# Altium schematic sheet Sheet1.SchDoc
size A2; PageSetup: Record=PageOptions?CenterHorizontal=True?CenterVertical=True?PrintScale=1.00?XCorrection=1.00?YCorrection=1.00?PrintKind=1?BorderSize=5000000?LeftOffset=0?BottomOffset=0?Orientation=2?PaperLength=1000?PaperWidth=1000?Scale=100?PaperSource=7?PrintQuality=-4?MediaType=1?DitherType=10?PaperKind=A4?PrintScaleMode=1
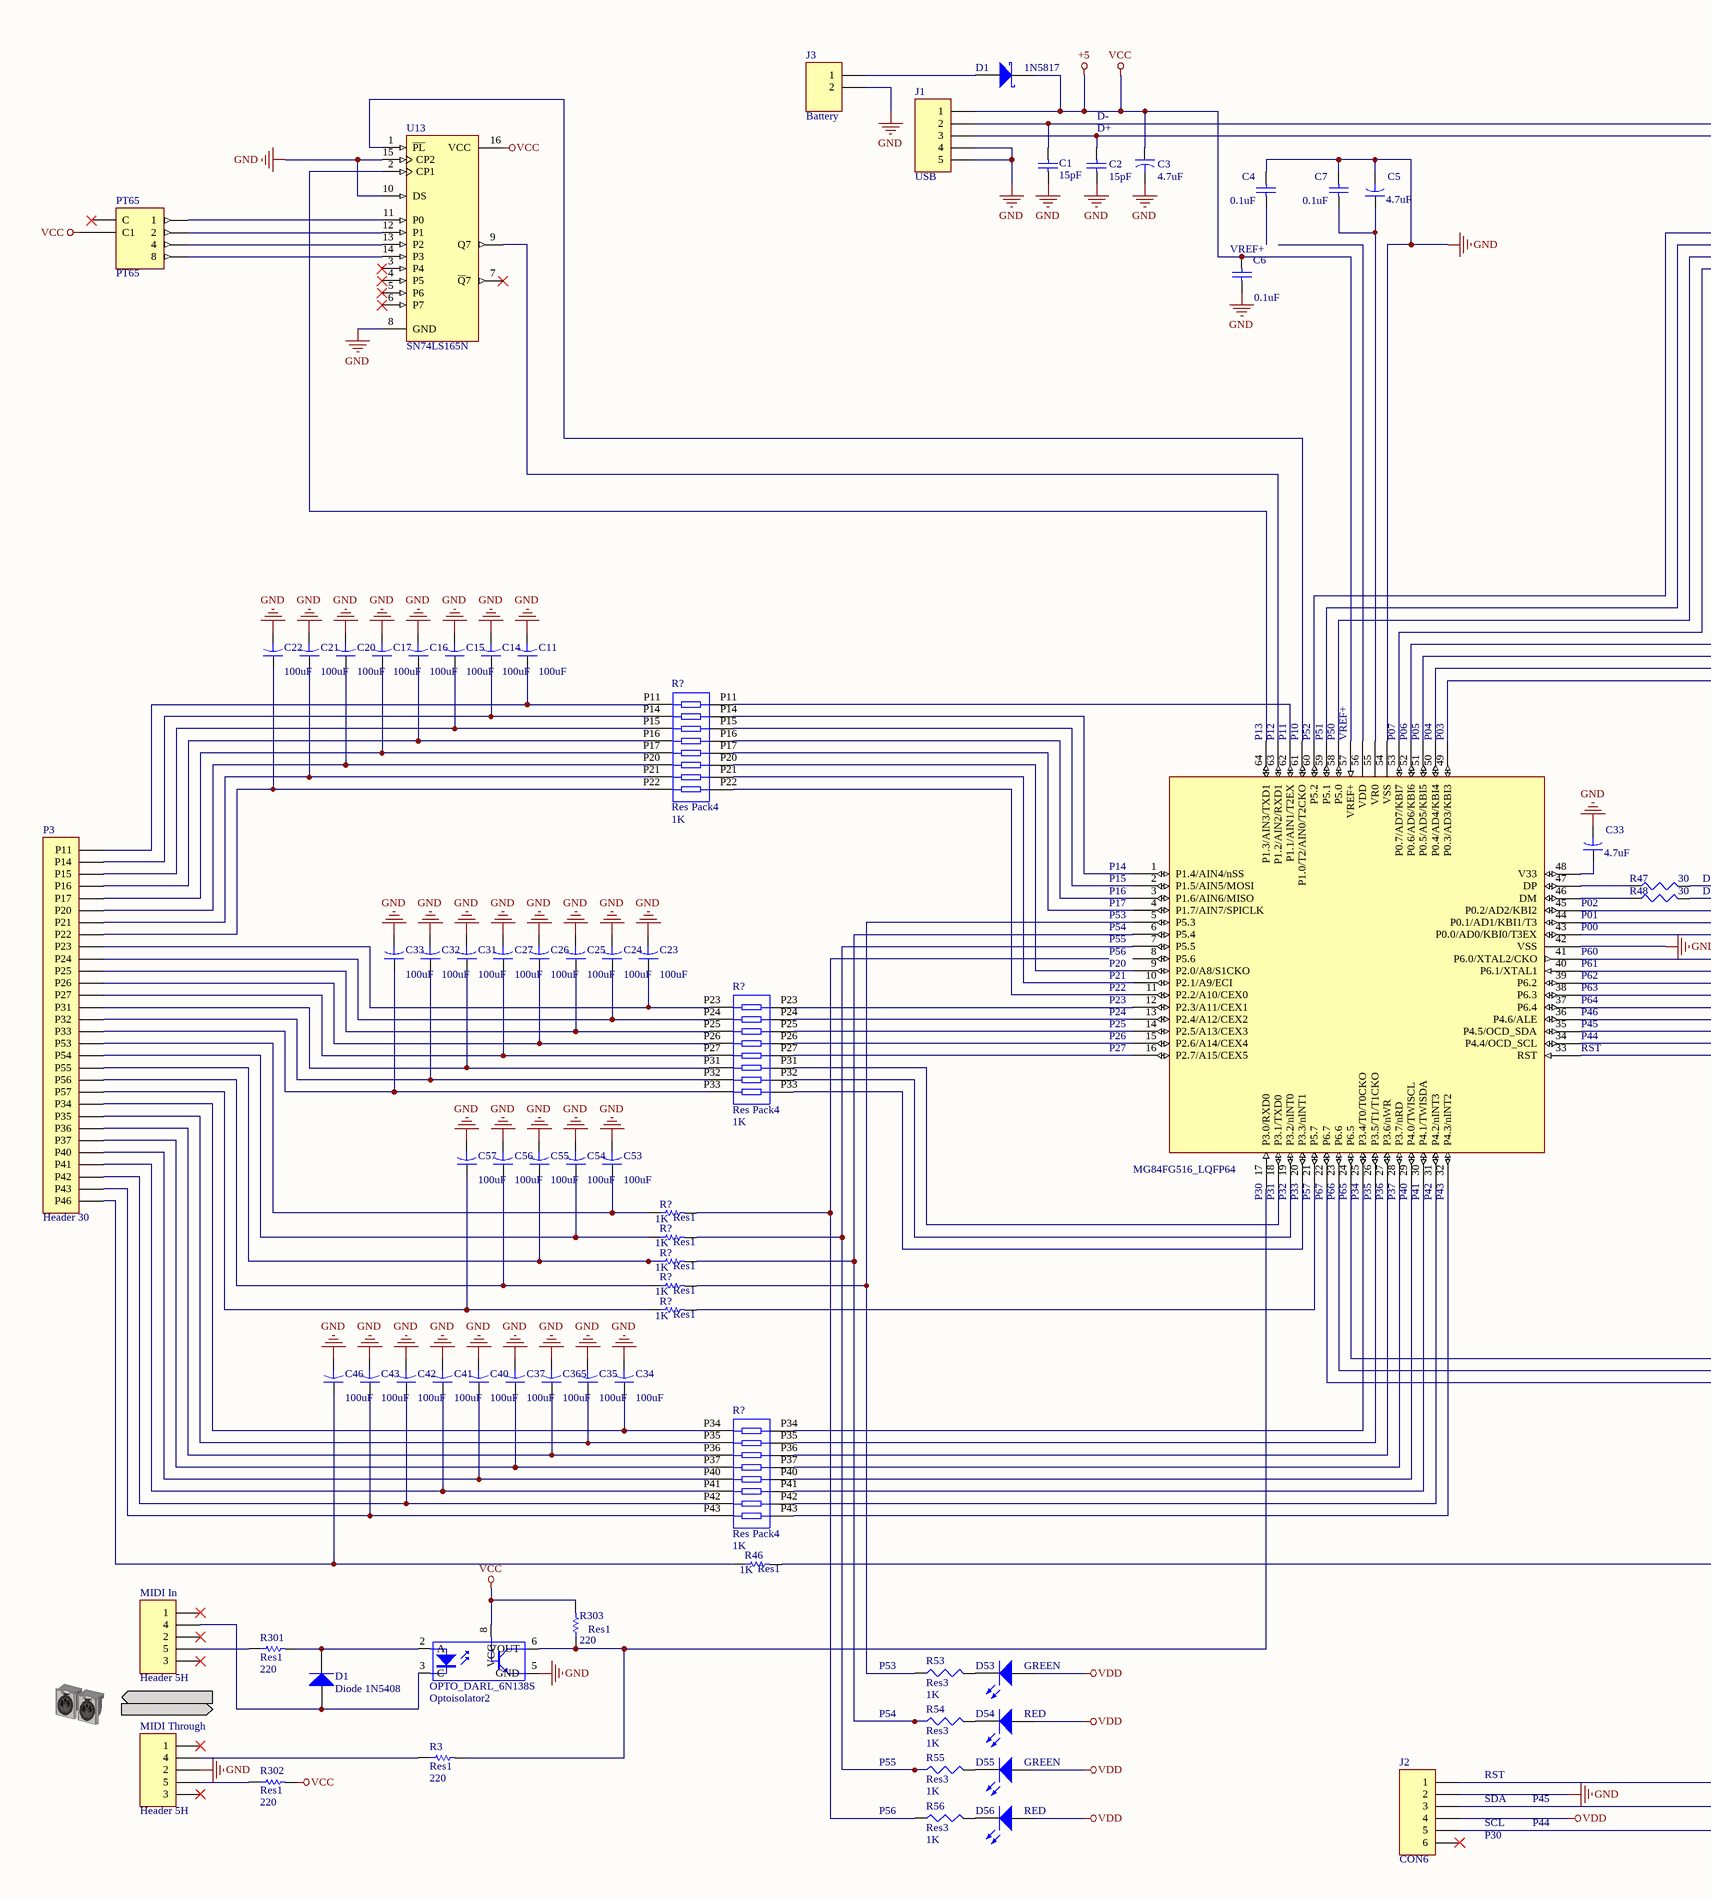
[diagram p0: Sheet1.SchDoc, left]
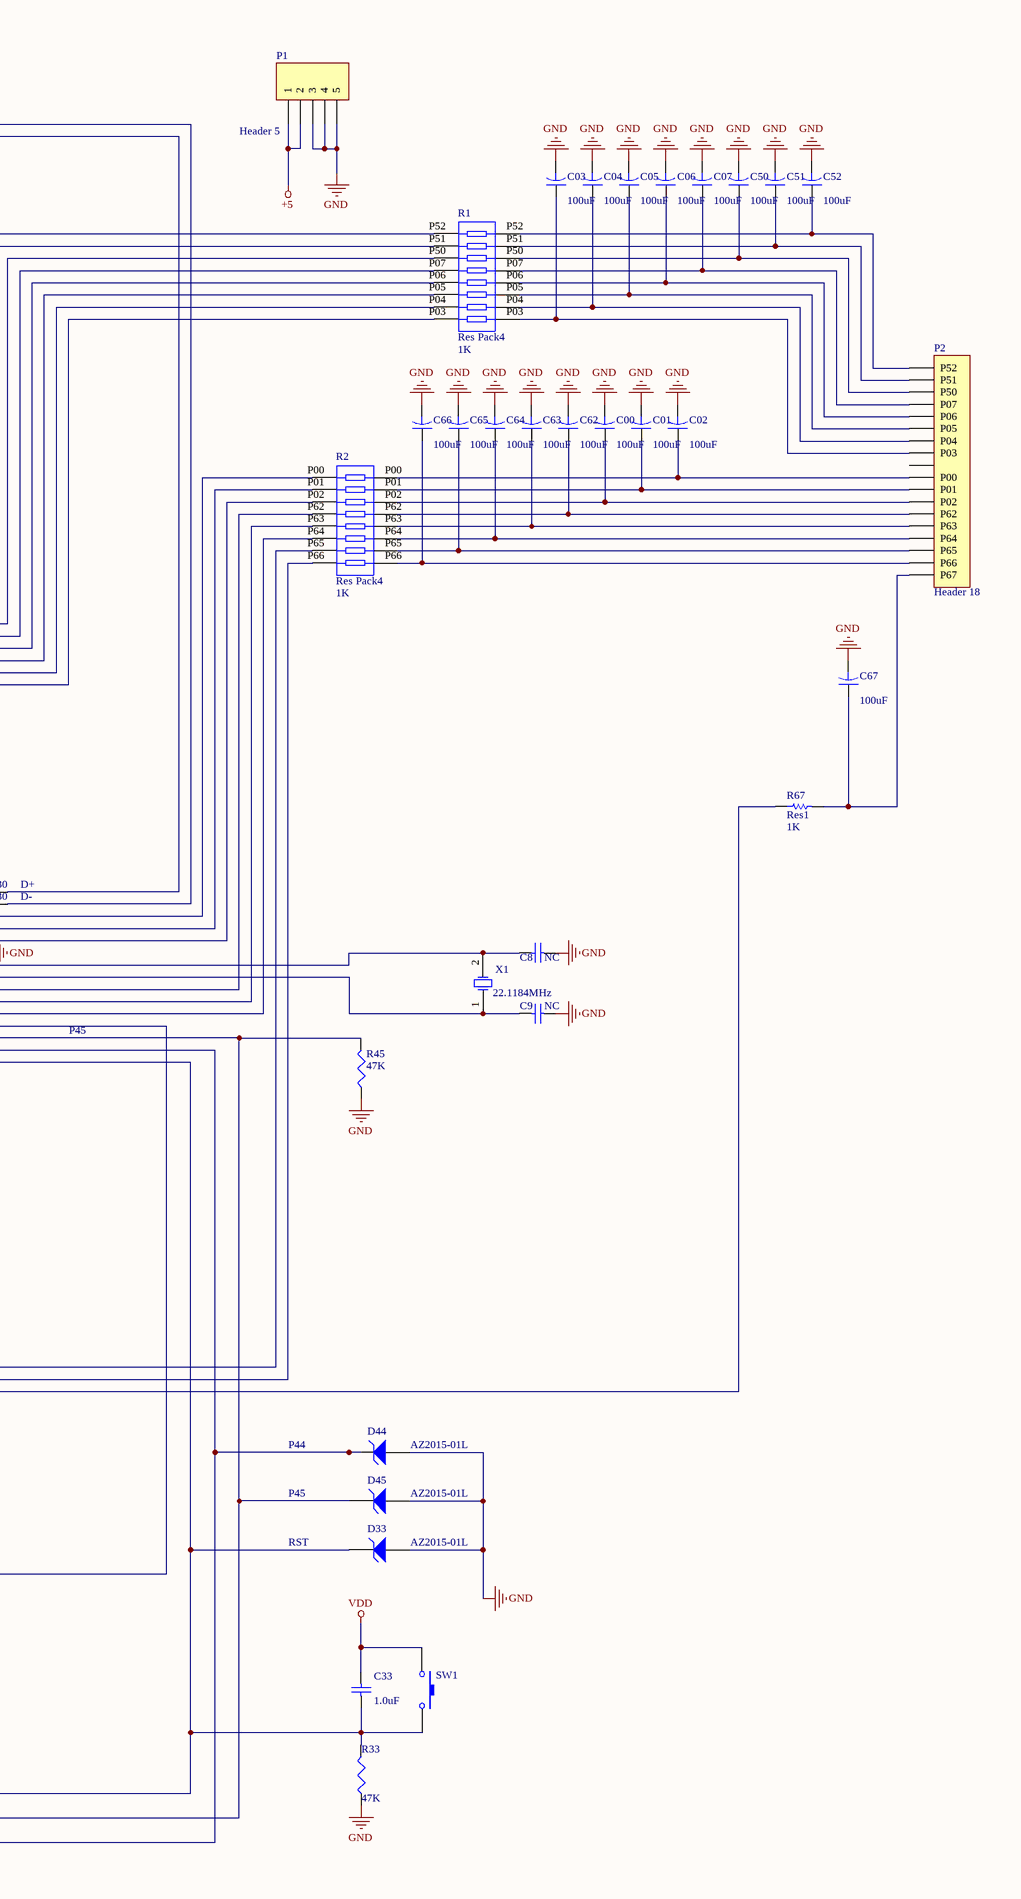
[diagram p1: Sheet1.SchDoc, right]

## Parts
(Parts that share a designator on the sheet are numbered #1, #2 ... from top to bottom, then left to right.)
4.7uF  value C3  [CAPR5-4X5]
30  R48  value 30  [J1-0603]
?#1  MG84FG516_LQFP64
?#2  MIDI  (value not drawn)
C00  value 100uF  [CAPR5-4X5]
C1  value 15pF  [C1206]
C01  value 100uF  [CAPR5-4X5]
C2  value 15pF  [C1206]
C02  value 100uF  [CAPR5-4X5]
C03  value 100uF  [CAPR5-4X5]
C4  0.1uF  [C1206]
C04  value 100uF  [CAPR5-4X5]
C5  4.7uF  [CAPR5-4X5]
C05  value 100uF  [CAPR5-4X5]
C6  0.1uF  [RAD-0.3]
C06  value 100uF  [CAPR5-4X5]
C7  0.1uF  [C1206]
C07  value 100uF  [CAPR5-4X5]
C8  value NC  [C1206]
C9  value NC  [C1206]
C11  value 100uF  [CAPR5-4X5]
C14  value 100uF  [CAPR5-4X5]
C15  value 100uF  [CAPR5-4X5]
C16  value 100uF  [CAPR5-4X5]
C17  value 100uF  [CAPR5-4X5]
C20  value 100uF  [CAPR5-4X5]
C21  value 100uF  [CAPR5-4X5]
C22  value 100uF  [CAPR5-4X5]
C23  value 100uF  [CAPR5-4X5]
C24  value 100uF  [CAPR5-4X5]
C25  value 100uF  [CAPR5-4X5]
C26  value 100uF  [CAPR5-4X5]
C27  value 100uF  [CAPR5-4X5]
C31  value 100uF  [CAPR5-4X5]
C32  value 100uF  [CAPR5-4X5]
C33#1  4.7uF  [CAPR5-4X5]
C33#2  value 100uF  [CAPR5-4X5]
C33#3  value 1.0uF  [C1206]
C34  value 100uF  [CAPR5-4X5]
C35  value 100uF  [CAPR5-4X5]
C37  value 100uF  [CAPR5-4X5]
C40  value 100uF  [CAPR5-4X5]
C41  value 100uF  [CAPR5-4X5]
C42  value 100uF  [CAPR5-4X5]
C43  value 100uF  [CAPR5-4X5]
C46  value 100uF  [CAPR5-4X5]
C50  value 100uF  [CAPR5-4X5]
C51  value 100uF  [CAPR5-4X5]
C52  value 100uF  [CAPR5-4X5]
C53  value 100uF  [CAPR5-4X5]
C54  value 100uF  [CAPR5-4X5]
C55  value 100uF  [CAPR5-4X5]
C56  value 100uF  [CAPR5-4X5]
C57  value 100uF  [CAPR5-4X5]
C62  value 100uF  [CAPR5-4X5]
C63  value 100uF  [CAPR5-4X5]
C64  value 100uF  [CAPR5-4X5]
C65  value 100uF  [CAPR5-4X5]
C66  value 100uF  [CAPR5-4X5]
C67  value 100uF  [CAPR5-4X5]
C365  value 100uF  [CAPR5-4X5]
D1#1  1N5817  [TO-220AC]
D1#2  Diode 1N5408  [DO-201AD]
D33  AZ2015-01L  [DIODE-0.7]
D44  AZ2015-01L  [DIODE-0.7]
D45  AZ2015-01L  [DIODE-0.7]
D53  GREEN  [LED-1]
D54  RED  [LED-1]
D55  GREEN  [LED-1]
D56  RED  [LED-1]
J1  (no value)  [HDR1X5]
J2  CON6  [HDR1X6]
J3  Battery  [HDR1X3]
MIDI_In  Header 5H  [HDR1X5H]
MIDI_Through  Header 5H  [HDR1X5H]
OPTO_DARL_6N138S  Optoisolator2  [SOP5(6)]
P1  Header 5  [HDR1X5]
P2  Header 18  [HDR1X18]
P3  Header 30  [HDR1X30]
PT65  PT65  [HDR2X4]
R1  Res Pack4  value 1K  [SSOP16_N]
R2  Res Pack4  value 1K  [SSOP16_N]
R3  Res1  value 220  [AXIAL-0.3]
R33  value 47K  [J1-0603]
R45  value 47K  [J1-0603]
R46  Res1  value 1K  [AXIAL-0.3]
R47  (no value)  [J1-0603]
R53  Res3  value 1K  [J1-0603]
R54  Res3  value 1K  [J1-0603]
R55  Res3  value 1K  [J1-0603]
R56  Res3  value 1K  [J1-0603]
R67  Res1  value 1K  [AXIAL-0.3]
R301  Res1  value 220  [AXIAL-0.3]
R302  Res1  value 220  [AXIAL-0.3]
R303  Res1  value 220  [AXIAL-0.3]
R?#1  Res Pack4  value 1K  [SSOP16_N]
R?#2  Res Pack4  value 1K  [SSOP16_N]
R?#3  Res1  value 1K  [AXIAL-0.3]
R?#4  Res1  value 1K  [AXIAL-0.3]
R?#5  Res1  value 1K  [AXIAL-0.3]
R?#6  Res1  value 1K  [AXIAL-0.3]
R?#7  Res1  value 1K  [AXIAL-0.3]
R?#8  Res Pack4  value 1K  [SSOP16_N]
SW1  (no value)  [SPST-2]
U13  SN74LS165N  [648-08]
X1  22.1184MHz  [R38]

## Nets
+5: 4.7uF.1 ?#1.57(VREF+) C6.2 D1#1.1(K) J1.1 OPTO_DARL_6N138S.8(VCC) P1.1 P1.2 PT65.C1 R302.2 R303.2 U13.16(VCC)  [also labelled VCC]
GND: 4.7uF.2 ?#1.42(VSS) ?#1.54(VSS) C00.2 C1.1 C01.2 C2.1 C02.2 C03.2 C4.2 C04.2 C5.2 C05.2 C6.1 C06.2 C7.2 C07.2 C8.1 C9.1 C11.2 C14.2 C15.2 C16.2 C17.2 C20.2 C21.2 C22.2 C23.2 C24.2 C25.2 C26.2 C27.2 C31.2 C32.2 C33#1.2 C33#2.2 C34.2 C35.2 C37.2 C40.2 C41.2 C42.2 C43.2 C46.2 C50.2 C51.2 C52.2 C53.2 C54.2 C55.2 C56.2 C57.2 C62.2 C63.2 C64.2 C65.2 C66.2 C67.2 C365.2 D33.1(A) D44.1(A) D45.1(A) J1.4 J1.5 J2.2 J3.2 MIDI_Through.2 OPTO_DARL_6N138S.5(GND) P1.3 P1.4 P1.5 R33.1 R45.1 U13.8(GND) U13.10(DS) U13.15(CP2)
VDD: C33#3.1 D53.1(A) D54.1(A) D55.1(A) D56.1(A) J2.4 SW1.1
Net30_1: 30.1 ?#1.46(DM)
Net30_2: 30.2 C1.2 J1.2
Net?#1_1: ?#1.1(P1.4/AIN4/nSS) R?#1.P14
Net?#1_2: ?#1.2(P1.5/AIN5/MOSI) R?#1.P15
Net?#1_3: ?#1.3(P1.6/AIN6/MISO) R?#1.P16
Net?#1_4: ?#1.4(P1.7/AIN7/SPICLK) R?#1.P17
Net?#1_5: ?#1.5(P5.3) R53.1 R?#6.2
Net?#1_6: ?#1.6(P5.4) R54.1 R?#5.2
Net?#1_7: ?#1.7(P5.5) R55.1 R?#4.2
Net?#1_9: ?#1.9(P2.0/A8/S1CKO) R?#1.P20
Net?#1_10: ?#1.10(P2.1/A9/ECI) R?#1.P21
Net?#1_11: ?#1.11(P2.2/A10/CEX0) R?#1.P22
Net?#1_12: ?#1.12(P2.3/A11/CEX1) R?#2.P23
Net?#1_13: ?#1.13(P2.4/A12/CEX2) R?#2.P24
Net?#1_14: ?#1.14(P2.5/A13/CEX3) R?#2.P25
Net?#1_15: ?#1.15(P2.6/A14/CEX4) R?#2.P26
Net?#1_16: ?#1.16(P2.7/A15/CEX5) R?#2.P27
Net?#1_17: ?#1.17(P3.0/RXD0) OPTO_DARL_6N138S.6(VOUT) R3.2 R303.1
Net?#1_18: ?#1.18(P3.1/TXD0) R?#2.P31
Net?#1_19: ?#1.19(P3.2/nINT0) R?#2.P32
Net?#1_20: ?#1.20(P3.3/nINT1) R?#2.P33
Net?#1_21: ?#1.21(P5.7) R?#7.2
Net?#1_22: ?#1.22(P6.7) R67.1
Net?#1_23: ?#1.23(P6.6) R2.P66
Net?#1_24: ?#1.24(P6.5) R2.P65
Net?#1_25: ?#1.25(P3.4/T0/T0CKO) R?#8.P34
Net?#1_26: ?#1.26(P3.5/T1/T1CKO) R?#8.P35
Net?#1_27: ?#1.27(P3.6/nWR) R?#8.P36
Net?#1_28: ?#1.28(P3.7/nRD) R?#8.P37
Net?#1_29: ?#1.29(P4.0/TWISCL) R?#8.P40
Net?#1_30: ?#1.30(P4.1/TWISDA) R?#8.P41
Net?#1_31: ?#1.31(P4.2/nINT3) R?#8.P42
Net?#1_32: ?#1.32(P4.3/nINT2) R?#8.P43
Net?#1_33: ?#1.33(RST) C33#3.2 D33.2(K) J2.1 R33.2 SW1.2
Net?#1_34: ?#1.34(P4.4/OCD_SCL) D44.2(K) J2.5
Net?#1_35: ?#1.35(P4.5/OCD_SDA) D45.2(K) J2.3 R45.2
Net?#1_36: ?#1.36(P4.6/ALE) R46.2
Net?#1_37: ?#1.37(P6.4) R2.P64
Net?#1_38: ?#1.38(P6.3) R2.P63
Net?#1_39: ?#1.39(P6.2) R2.P62
Net?#1_40: ?#1.40(P6.1/XTAL1) C9.2 X1.1(OSC1)
Net?#1_41: ?#1.41(P6.0/XTAL2/CKO) C8.2 X1.2(OSC2)
Net?#1_43: ?#1.43(P0.0/AD0/KBI0/T3EX) R2.P02
Net?#1_44: ?#1.44(P0.1/AD1/KBI1/T3) R2.P01
Net?#1_45: ?#1.45(P0.2/AD2/KBI2) R2.P00
Net?#1_47: ?#1.47(DP) R47.1
Net?#1_48: ?#1.48(V33) C33#1.1
Net?#1_49: ?#1.49(P0.3/AD3/KBI3) R1.P03
Net?#1_50: ?#1.50(P0.4/AD4/KBI4) R1.P04
Net?#1_51: ?#1.51(P0.5/AD5/KBI5) R1.P05
Net?#1_52: ?#1.52(P0.6/AD6/KBI6) R1.P06
Net?#1_53: ?#1.53(P0.7/AD7/KBI7) R1.P07
Net?#1_55: ?#1.55(VR0) C5.1 C7.1
Net?#1_58: ?#1.58(P5.0) R1.P50
Net?#1_59: ?#1.59(P5.1) R1.P51
Net?#1_60: ?#1.60(P5.2) R1.P52
Net?#1_61: ?#1.61(P1.0/T2/AIN0/T2CKO) U13.1(~{PL})
Net?#1_62: ?#1.62(P1.1/AIN1/T2EX) R?#1.P11
Net?#1_63: ?#1.63(P1.2/AIN2/RXD1) U13.9(Q7)
Net?#1_64: ?#1.64(P1.3/AIN3/TXD1) U13.2(CP1)
NetC00_1: C00.1 P2.P02 R2.P02
NetC01_1: C01.1 P2.P01 R2.P01
NetC02_1: C02.1 P2.P00 R2.P00
NetC2_2: C2.2 J1.3 R47.2
NetC03_1: C03.1 P2.P03 R1.P03
NetC04_1: C04.1 P2.P04 R1.P04
NetC05_1: C05.1 P2.P05 R1.P05
NetC06_1: C06.1 P2.P06 R1.P06
NetC07_1: C07.1 P2.P07 R1.P07
NetC11_1: C11.1 P3.P11 R?#1.P11
NetC14_1: C14.1 P3.P14 R?#1.P14
NetC15_1: C15.1 P3.P15 R?#1.P15
NetC16_1: C16.1 P3.P16 R?#1.P16
NetC17_1: C17.1 P3.P17 R?#1.P17
NetC20_1: C20.1 P3.P20 R?#1.P20
NetC21_1: C21.1 P3.P21 R?#1.P21
NetC22_1: C22.1 P3.P22 R?#1.P22
NetC23_1: C23.1 P3.P23 R?#2.P23
NetC24_1: C24.1 P3.P24 R?#2.P24
NetC25_1: C25.1 P3.P25 R?#2.P25
NetC26_1: C26.1 P3.P26 R?#2.P26
NetC27_1: C27.1 P3.P27 R?#2.P27
NetC31_1: C31.1 P3.P31 R?#2.P31
NetC32_1: C32.1 P3.P32 R?#2.P32
NetC33#2_1: C33#2.1 P3.P33 R?#2.P33
NetC34_1: C34.1 P3.P34 R?#8.P34
NetC35_1: C35.1 P3.P35 R?#8.P35
NetC37_1: C37.1 P3.P37 R?#8.P37
NetC40_1: C40.1 P3.P40 R?#8.P40
NetC41_1: C41.1 P3.P41 R?#8.P41
NetC42_1: C42.1 P3.P42 R?#8.P42
NetC43_1: C43.1 P3.P43 R?#8.P43
NetC46_1: C46.1 P3.P46 R46.1
NetC50_1: C50.1 P2.P50 R1.P50
NetC51_1: C51.1 P2.P51 R1.P51
NetC52_1: C52.1 P2.P52 R1.P52
NetC53_1: C53.1 P3.P53 R?#3.1
NetC54_1: C54.1 P3.P54 R?#4.1
NetC55_1: C55.1 P3.P55 R?#5.1
NetC56_1: C56.1 P3.P56 R?#6.1
NetC57_1: C57.1 P3.P57 R?#7.1
NetC62_1: C62.1 P2.P62 R2.P62
NetC63_1: C63.1 P2.P63 R2.P63
NetC64_1: C64.1 P2.P64 R2.P64
NetC65_1: C65.1 P2.P65 R2.P65
NetC66_1: C66.1 P2.P66 R2.P66
NetC67_1: C67.1 P2.P67 R67.2
NetC365_1: C365.1 P3.P36 R?#8.P36
NetD1#1_3: D1#1.3(A) J3.1
NetD1#2_1: D1#2.1(A) MIDI_In.4 OPTO_DARL_6N138S.3(C)
NetD1#2_2: D1#2.2(K) OPTO_DARL_6N138S.2(A) R301.2
NetD53_2: D53.2(K) R53.2
NetD54_2: D54.2(K) R54.2
NetD55_2: D55.2(K) R55.2
NetD56_2: D56.2(K) R56.2
NetMIDI_In_5: MIDI_In.5 R301.1
NetMIDI_Through_4: MIDI_Through.4 R3.1
NetMIDI_Through_5: MIDI_Through.5 R302.1
NetPT65_1: PT65.1 U13.11(P0)
NetPT65_2: PT65.2 U13.12(P1)
NetPT65_4: PT65.4 U13.13(P2)
NetPT65_8: PT65.8 U13.14(P3)
NetR56_1: R56.1 R?#3.2

Not connected (* = marked no-connect by the designer): ?#1 8(P5.6) 56(VDD); C4 1; J2 6*; MIDI_In 1* 2* 3*; MIDI_Through 1* 3*; P2 Empty; PT65 C*; U13 3(P4)* 4(P5)* 5(P6)* 6(P7)* 7(~{Q}7)*

## Notes on the sheet
- D-
- (near C2) D+
- (near C6) VREF+
- P13
- P12
- P11
- P10
- P52
- P51
- P50
- VREF+
- P07
- P06
- P05
- P04
- P03
- P14
- P15
- P16
- P17
- P02
- D+
- P53
- P54
- P55
- P56
- P20
- P01
- P00
- P60
- P61
- P21
- P22
- P23
- P24
- P25
- P62
- P63
- P64
- P46
- P45
- P26
- P27
- P44
- RST
- P30
- P31
- P32
- P33
- P57
- P67
- P66
- P65
- P34
- P35
- P36
- P37
- P40
- P41
- P42
- P43
- (near R53) P53
- SDA
- SCL
- Labels drawn without touching a wire or pin: VCC
- (in symbol Header 5) USB

## Library data of the parts
4.7uF C00 C01 C02 C03 C04 C5 C05 C06 C07 C11 C14-C17 C20-C27 C31 C32 C33#1 C33#2 C34 C35 C37 C40-C43 C46 C50-C57 C62-C67 C365 = Cap2: Capacitor; Published: 23-Sep-2002; PackageReference: CAPR5-4X5; Publisher: Altium Limited; PackageDescription: Capacitor; 2 Leads
30 = Res3: Published: 8-Jun-2000; LatestRevisionDate: 29-May-2009; LatestRevisionNote: IPC-7351 Footprint Added.; PackageReference: J1-0603; Publisher: Altium Limited; PackageDescription: Chip Resistor
?#1 = MG84FG516-2
?#2 = MIDI: MIDI Connector; PortComponent: True; Published: 16-Mar-2009; Publisher: Altium Limited; HelpURL: https://wiki.altium.com/display/ADOH/NanoBoard+3000+-+MIDI+Interface
C1 C2 C4 C7-C9 C33#3 = Cap Semi: Capacitor (Semiconductor SIM Model); Published: 8-Jun-2000; LatestRevisionDate: 29-May-2009; LatestRevisionNote: IPC-7351 Footprint Added.; PackageReference: C1206; Publisher: Altium Limited; PackageDescription: Chip Capacitor
C6 = Cap: Capacitor; Published: 8-Jun-2000; LatestRevisionDate: 17-Jul-2002; LatestRevisionNote: Re-released for DXP Platform.; PackageReference: RAD-0.3; Publisher: Altium Limited; PackageDescription: Radial Cap, Thru-Hole; 2 Leads; 0.3 in Pin Spacing
D1#1 = Diode 10TQ040: Schottky Rectifier; Note: Terminal 2 is the TAB and is electrically connected to the cathode; Published: 8-Jun-2000; LatestRevisionDate: 17-Jul-2002; LatestRevisionNote: Re-released for DXP Platform.; DatasheetVersion: PD-2.057B; PackageVersion: Feb-1998; PackageReference: TO-220AC; Publisher: Altium Limited; PackageDescription: TO, Thru-Hole, Vertical, Heatsink Mounted; 3 In-Line Leads (1 Absent); Pitch 2.54 mm; ComponentLink1Description: Manufacturer Link; ComponentLink1URL: http://www.irf.com/
D1#2 = Diode 1N5408: 3 Amp Medium Power Silicon Rectifier Diode; Published: 8-Jun-2000; LatestRevisionDate: 17-Jul-2002; LatestRevisionNote: Re-released for DXP Platform.; DatasheetVersion: Aug-1984; PackageReference: DO-201AD; Publisher: Altium Limited; PackageDescription: Diode, Axial; Body 9.5 x 5.3 mm (LxDia. max), Lead Dia. 1.32 mm (max); ComponentLink1Description: Manufacturer Link; ComponentLink1URL: http://www.irf.com/
D33 D44 D45 = D Zener: Zener Diode; Published: 8-Jun-2000; LatestRevisionDate: 17-Jul-2002; LatestRevisionNote: Re-released for DXP Platform.; PackageReference: DIODE-0.7; Publisher: Altium Limited; PackageDescription: Diode, Thru-Hole; 2 Leads; 0.7 in Pin Spacing
D53-D56 = LED1: Typical RED GaAs LED; Published: 8-Jun-2000; LatestRevisionDate: 08-Jul-2005; LatestRevisionNote: Mech Layer 1 removed.; PackageReference: LED-1; Publisher: Altium Limited; PackageDescription: LED; 2 Leads
J1 P1 = Header 5: Header, 5-Pin; LatestRevisionDate: 17-Jul-2002; LatestRevisionNote: Re-released for DXP Platform.; Publisher: Altium Limited
J2 = Header 6: Header, 6-Pin; LatestRevisionDate: 17-Jul-2002; LatestRevisionNote: Re-released for DXP Platform.; Publisher: Altium Limited
J3 = Header 3: Header, 3-Pin; LatestRevisionDate: 17-Jul-2002; LatestRevisionNote: Re-released for DXP Platform.; Publisher: Altium Limited
MIDI_In MIDI_Through = Header 5H: Header, 5-Pin, Right Angle; LatestRevisionDate: 17-Jul-2002; LatestRevisionNote: Re-released for DXP Platform.; Publisher: Altium Limited
OPTO_DARL_6N138S = Optoisolator2: 5 Pin Mini Flat Pack Optocoupler; Published: 24-Mar-1999; LatestRevisionDate: 04-Mar-2005; LatestRevisionNote: PCB Footprint replaced, Sch pins re-numbered.; DatasheetVersion: Apr-2004; PackageReference: SOP5(6); Publisher: Altium Limited; PackageDescription: Small Outline; 6 Leads (1 Absent); Body Width 4.4 mm; Pitch 1.27 mm
P2 = Header 18: Header, 18-Pin; LatestRevisionDate: 17-Jul-2002; LatestRevisionNote: Re-released for DXP Platform.; Publisher: Altium Limited
P3 = Header 30: Header, 30-Pin; LatestRevisionDate: 17-Jul-2002; LatestRevisionNote: Re-released for DXP Platform.; Publisher: Altium Limited
PT65 = Header 4X2: Header, 4-Pin, Dual row; LatestRevisionDate: 17-Jul-2002; LatestRevisionNote: Re-released for DXP Platform.; Publisher: Altium Limited
R1 R2 R?#1 R?#2 R?#8 = Res Pack4: Isolated Resistor Network; Published: 24-Mar-1999; LatestRevisionDate: 29-May-2009; LatestRevisionNote: IPC-7351 Footprint Added.; PackageVersion: Oct-2003; PackageReference: SSOP16; Publisher: Altium Limited; PackageDescription: 16-Pin Plastic Small Outline Package 0.65 mm Pitch; Code_JEDEC: MO-150-AC; Code_IPC: SOP65P780-16
R3 R46 R67 R301-R303 R?#3-R?#7 = Res1: Resistor; Published: 8-Jun-2000; LatestRevisionDate: 17-Jul-2002; LatestRevisionNote: Re-released for DXP Platform.; PackageReference: AXIAL-0.3; Publisher: Altium Limited; PackageDescription: Axial Device, Thru-Hole; 2 Leads; 0.3 in Pin Spacing
R33 R45 R47 R53-R56 = Res3: Resistor; Published: 8-Jun-2000; LatestRevisionDate: 29-May-2009; LatestRevisionNote: IPC-7351 Footprint Added.; PackageReference: J1-0603; Publisher: Altium Limited; PackageDescription: Chip Resistor
SW1 = SW-PB: Switch; Published: 24-Mar-1999; LatestRevisionDate: 17-Jul-2002; LatestRevisionNote: Re-released for DXP Platform.; PackageReference: SPST-2; Publisher: Altium Limited; PackageDescription: Switch; 2 Leads
U13 = SN74LS165N: 8-Bit Parallel-to-Serial Shift Register; ComponentAvailability: Not for New Design; Published: 15-Apr-2002; DatasheetVersion: Dec-1999; PackageVersion: Apr-2000; PackageReference: 648-08; Publisher: Altium Limited; PackageDescription: DIP; 16 Leads; Row Spacing 7.62 mm; Pitch 2.54 mm; Code_JEDEC: MS-001-BB; ComponentLink1Description: Manufacturer Link; ComponentLink1URL: http://www.onsemi.com/; ComponentLink2Description: Datasheet; ComponentLink2URL: http://www.onsemi.com/pub/Collateral/SN74LS165-D.PDF
X1 = XTAL: Crystal Oscillator; Published: 8-Jun-2000; LatestRevisionDate: 17-Jul-2002; LatestRevisionNote: Re-released for DXP Platform.; PackageReference: R38; Publisher: Altium Limited; PackageDescription: Crystal, Thru-Hole; 2 Leads; Body 3.1 x 8.2 mm (Dia.xH); MHz: 22.1184MHz